# Altium project LEDMiniCube.PrjPcb
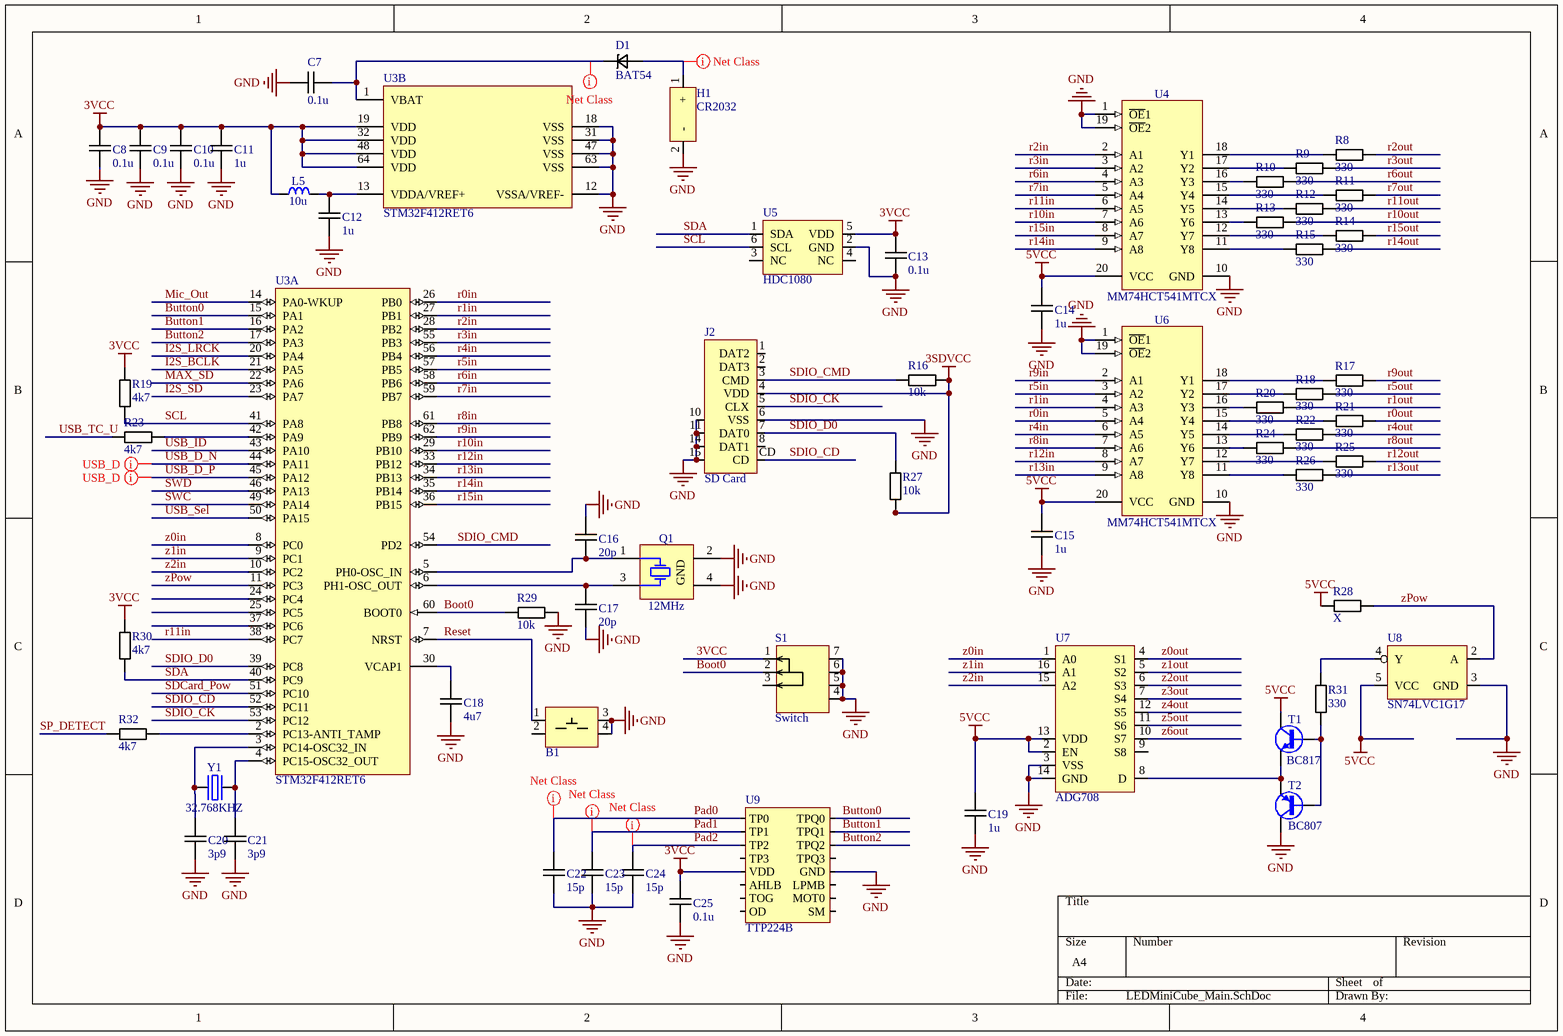
[diagram p0: LEDMiniCube_Main.SchDoc]
3 sheets, 142 parts. Net scope: global (net labels, ports and power ports of the same name join across sheets).
Board file: LEDMiniCube_PCB.PcbDoc
Sheets:
  LEDMiniCube_Main.SchDoc
  LEDMiniCube_PowerAndAnalog.SchDoc
  LEDMiniCube_AAmp.SchDoc

## Sheet LEDMiniCube_Main.SchDoc
size A4

### Parts
B1  Button 5.2  [Button 5.2x5.2]  (value not drawn)
C7  0.1u  [CAPC1608L]
C8  0.1u  [CAPC1608L]
C9  0.1u  [CAPC1608L]
C10  0.1u  [CAPC1608L]
C11  1u  [CAPC1608L]
C12  1u  [CAPC1608L]
C13  0.1u  [CAPC1608L]
C14  1u  [CAPC2012L]
C15  1u  [CAPC2012L]
C16  20p  [CAPC1608L]
C17  20p  [CAPC1608L]
C18  4u7  [CAPC2012L]
C19  1u  [CAPC2012L]
C20  3p9  [CAPC1608L]
C21  3p9  [CAPC1608L]
C22  15p  [CAPC1608L]
C23  15p  [CAPC1608L]
C24  15p  [CAPC1608L]
C25  0.1u  [CAPC1608L]
D1  BAT54  [SOD-323F]
H1  CR2032  [Battery Holder cr2032]
J2  SD Card  [XUNPU TF-115]
L5  10u  [IND_ABRACON_AISC-0603]
Q1  12MHz  [XTAL_TXC_7M]
R8  330  [RESC2012L]
R9  330  [RESC2012L]
R10  330  [RESC2012L]
R11  330  [RESC2012L]
R12  330  [RESC2012L]
R13  330  [RESC2012L]
R14  330  [RESC2012L]
R15  330  [RESC2012L]
R16  10k  [RESC1608L]
R17  330  [RESC2012L]
R18  330  [RESC2012L]
R19  4k7  [RESC1608L]
R20  330  [RESC2012L]
R21  330  [RESC2012L]
R22  330  [RESC2012L]
R23  4k7  [RESC1608L]
R24  330  [RESC2012L]
R25  330  [RESC2012L]
R26  330  [RESC2012L]
R27  10k  [RESC1608L]
R28  X  [RESC1608L]
R29  10k  [RESC1608L]
R30  4k7  [RESC1608L]
R31  330  [RESC1608L]
R32  4k7  [RESC1608L]
S1  Switch  [TA-3524A-A1]
T1  BC817  [SOT95P230X110-3N]
T2  BC807  [SOT95P230X110-3N]
U3  STM32F412RET6  [STM-LQFP64_N]  (parts A,B of 2)
U4  MM74HCT541MTCX  [TSOP65P640X120-20N]
U5  HDC1080  [WSON HDC1080]
U6  MM74HCT541MTCX  [TSOP65P640X120-20N]
U7  ADG708  [TSOP65P640X110-16N]
U8  SN74LVC1G17  [SOT23-5AL]
U9  TTP224B  [SOP65P640-16L]
Y1  32.768KHZ  [XTAL_ABRACON_ABS09]

### Nets
3SDVCC: J2.4(VDD) R16.2 R27.1
3VCC: C8.2 C9.2 C10.2 C11.2 C13.2 C25.2 L5.1 R19.2 R30.2 S1.1 U3.19(VDD) U3.32(VDD) U3.48(VDD) U3.64(VDD) U5.5(VDD) U9.6(VDD)
5VCC: C14.2 C15.2 C19.2 R28.2 T1.3(C) U4.20(VCC) U6.20(VCC) U7.2(EN) U7.13(VDD) U8.5(VCC)
GND: B1.3 B1.4 C7.2 C8.1 C9.1 C10.1 C11.1 C12.1 C13.1 C14.1 C15.1 C16.2 C17.1 C18.1 C19.1 C20.1 C21.1 C22.1 C23.1 C24.1 C25.1 H1.2(-) J2.6(VSS) J2.10 J2.11 J2.14 J2.15 Q1.2(GND) Q1.4(GND) R29.2 S1.4 S1.5 S1.6 S1.7 T2.3(C) U3.12(VSSA/VREF-) U3.18(VSS) U3.31(VSS) U3.47(VSS) U3.63(VSS) U4.1(~{OE}1) U4.10(GND) U4.19(~{OE}2) U5.2(GND) U6.1(~{OE}1) U6.10(GND) U6.19(~{OE}2) U7.3(VSS) U7.14(GND) U8.3(GND) U9.10(GND)
Boot0: R29.1 S1.2 U3.60(BOOT0)
Button0: U3.15(PA1) U9.16(TPQ0)
Button1: U3.16(PA2) U9.15(TPQ1)
Button2: U3.17(PA3) U9.14(TPQ2)
I2S_BCLK: U3.21(PA5)
I2S_LRCK: U3.20(PA4)
I2S_SD: U3.23(PA7)
MAX_SD: U3.22(PA6)
Mic_Out: U3.14(PA0-WKUP)
Pad0: C22.2 U9.1(TP0)
Pad1: C23.2 U9.2(TP1)
Pad2: C24.2 U9.3(TP2)
r0in: U3.26(PB0) U6.5(A4)
r0out: R21.2
r1in: U3.27(PB1) U6.4(A3)
r1out: R20.2
r2in: U3.28(PB2) U4.2(A1)
r2out: R8.2
r3in: U3.55(PB3) U4.3(A2)
r3out: R9.2
r4in: U3.56(PB4) U6.6(A5)
r4out: R22.2
r5in: U3.57(PB5) U6.3(A2)
r5out: R18.2
r6in: U3.58(PB6) U4.4(A3)
r6out: R10.2
r7in: U3.59(PB7) U4.5(A4)
r7out: R11.2
r8in: U3.61(PB8) U6.7(A6)
r8out: R24.2
r9in: U3.62(PB9) U6.2(A1)
r9out: R17.2
r10in: U3.29(PB10) U4.7(A6)
r10out: R13.2
r11in: U3.38(PC7) U4.6(A5)
r11out: R12.2
r12in: U3.33(PB12) U6.8(A7)
r12out: R25.2
r13in: U3.34(PB13) U6.9(A8)
r13out: R26.2
r14in: U3.35(PB14) U4.9(A8)
r14out: R15.2
r15in: U3.36(PB15) U4.8(A7)
r15out: R14.2
Reset: B1.1 U3.7(NRST)
SCL: R19.1 U3.41(PA8) U5.6(SCL)
SDA: R30.1 U3.40(PC9) U5.1(SDA)
SDCard_Pow: U3.51(PC10)
SDIO_CD: J2.CD U3.52(PC11)
SDIO_CK: J2.5(CLX) U3.53(PC12)
SDIO_CMD: J2.3(CMD) R16.1 U3.54(PD2)
SDIO_D0: J2.7(DAT0) R27.2 U3.39(PC8)
SP_DETECT: R32.1
SWC: U3.49(PA14)
SWD: U3.46(PA13)
USB_D_N: U3.44(PA11)
USB_D_P: U3.45(PA12)
USB_ID: U3.43(PA10)
USB_Sel: U3.50(PA15)
USB_TC_U: R23.1
z0in: U3.8(PC0) U7.1(A0)
z0out: U7.4(S1)
z1in: U3.9(PC1) U7.16(A1)
z1out: U7.5(S2)
z2in: U3.10(PC2) U7.15(A2)
z2out: U7.6(S3)
z3out: U7.7(S4)
z4out: U7.12(S5)
z5out: U7.11(S6)
z6out: U7.10(S7)
zPow: R28.1 U3.11(PC3) U8.2(A)
NetC7_1: C7.1 D1.2 U3.1(VBAT)
NetC12_2: C12.2 L5.2 U3.13(VDDA/VREF+)
NetC16_1: C16.1 Q1.1(X) U3.5(PH0-OSC_IN)
NetC17_2: C17.2 Q1.3(X) U3.6(PH1-OSC_OUT)
NetC18_2: C18.2 U3.30(VCAP1)
NetC20_2: C20.2 U3.3(PC14-OSC32_IN) Y1.1(OSC1)
NetC21_2: C21.2 U3.4(PC15-OSC32_OUT) Y1.2(OSC2)
NetD1_1: D1.1 H1.1(+)
NetR8_1: R8.1 U4.18(Y1)
NetR9_1: R9.1 U4.17(Y2)
NetR10_1: R10.1 U4.16(Y3)
NetR11_1: R11.1 U4.15(Y4)
NetR12_1: R12.1 U4.14(Y5)
NetR13_1: R13.1 U4.13(Y6)
NetR14_1: R14.1 U4.12(Y7)
NetR15_1: R15.1 U4.11(Y8)
NetR17_1: R17.1 U6.18(Y1)
NetR18_1: R18.1 U6.17(Y2)
NetR20_1: R20.1 U6.16(Y3)
NetR21_1: R21.1 U6.15(Y4)
NetR22_1: R22.1 U6.14(Y5)
NetR23_2: R23.2 U3.42(PA9)
NetR24_1: R24.1 U6.13(Y6)
NetR25_1: R25.1 U6.12(Y7)
NetR26_1: R26.1 U6.11(Y8)
NetR31_1: R31.1 T1.1(B) T2.1(B)
NetR31_2: R31.2 U8.4(Y)
NetR32_2: R32.2 U3.2(PC13-ANTI_TAMP)
NetT1_2: T1.2(E) T2.2(E) U7.8(D)

Not connected (* = marked no-connect by the designer): B1 2; J2 1(DAT2) 2(DAT3) 8(DAT1); S1 3; U3 24(PC4) 25(PC5) 37(PC6); U5 3(NC) 4(NC); U7 9(S8); U9 4(TP3) 5(AHLB) 7(TOG) 8(LPMB) 9(MOT0) 11(OD) 12(SM) 13(TPQ3)

### Layout directives
differential pair: USB_D_N, USB_D_P
net class Clearance5; rule Clearance Constraint [Generic clearance = 0.15mm, and 30 value(s) for objects]: NetD1_1
net class Clearance5; rule Clearance Constraint [Generic clearance = 0.15mm, and 21 value(s) for objects]: NetC7_1
net class Clearance5: Pad0, Pad1, Pad2

### Library data of the parts
C7-C25 = Capacitor: Name: *; Case: *
  C7-C10 C13 C25: Value: 0.1u
  C11 C12 C14 C15 C19: Value: 1u
  C16 C17: Value: 20p
  C18: Value: 4u7
  C20 C21: Value: 3p9
  C22-C24: Value: 15p
D1 = Schotky: Name: BAT54; Case: *; Value: *
J2 = SD Card Socket: Name: SD Card
L5 = IND_390NH_5%_ABRACON_AISC-0603: Inductor; Value: 10u; Author: CERN DEM JLC
Q1 = XTAL_12MHZ_TXC_7M-12.000MAAJ-T: Crystal 4 pins 1=XTAL Control 2=GND3=XTAL 4=GND; Part Description: ±30ppm 18pF -20°C to +70°C  4 Pins, 3.2x2.5X0.8mm, SMD Sealing Crystal, 7M Series; Manufacturer: TXC CORPORATION; PressFit: No; Bonding: No; Part Number: XTAL_12MHZ_TXC_7M-12.000MAAJ-T; Component Kind: Standard; Component Type: Standard; PackageDescription: 4 Pins, 2.5x3.2mm, SMD Sealing Crystal, 7M Serie; Value: 12MHz; Manufacturer Part Number: 7M-12.000MAAJ-T; Pin Count: 4; Mounted: Yes; Socket: No; SMD: Yes; Sense: No; ComponentHeight: 0.8mm; HelpURL: \\cern.ch\dfs\Applications\Altium\Datasheets\XTAL_TXC_7M.pdf; Author: CERN DEM JLC; CreateDate: 19.06.2012; LatestRevisionDate: 19.06.2012
R8-R32 = Resistor: Model: *; Case: *
  R8-R15 R17 R18 R20-R22 R24-R26 R31: Value: 330
  R16 R27 R29: Value: 10k
  R19 R23 R30 R32: Value: 4k7
  R28: Value: X
T1 = BC817: NPN Transistor; Part Number: BC817-40; Device: BC817; Author: CERN DEM JLC
T2 = BC807-25: PNP Transistor; Part Number: BC807-40; Device: BC807; Author: CERN DEM JLC
U3 = STM32F401RBT6: ARM Cortex-M4 32-bit MCU+FPU, 105 DMIPS, 128 kB Flash, 64 kB Internal RAM, 48 I/Os, 64-pin LQFP, -40 to 85 degC, Tray; PartNumber: STM32F412RET6
U4 U6 = 74541: Octal Buffer/Line Driver with 3-State Outputs; Device: MM74HCT541MTCX
U7 = ADG708: Part: ADG708BRUZ; Name: ADG708
U8 = SN74LVC1G04: Part: SN74LVC1G17DBVR; Name: SN74LVC1G17
U9 = TTP224: Name: TTP224B
Y1 = XTAL_32.768KHZ_ABRACON_ABS09-32.768KHZ-T: Quartz Crystal; Part Description: Tolerance: ±20ppm, Stability: ±5ppm, -40°C to +85°C, 12.5pF, SMD Low Profile Crystal, ABS09 Series; PressFit: No; Bonding: No; Part Number: XTAL_32.768KHZ_ABRACON_ABS09-32.768KHZ-T; Component Kind: Standard; Component Type: Standard; PackageDescription: 2 Pins, 4.1x1.5mm, SMD Low Profile Crystal, ABS09 Serie; Value: 32.768KHZ; Manufacturer: ABRACON; Manufacturer Part Number: ABS09-32.768KHZ-T; Pin Count: 2; Mounted: Yes; Socket: No; SMD: Yes; Sense: No; ComponentHeight: 0.9mm; HelpURL: \\cern.ch\dfs\Applications\Altium\Datasheets\XTAL_ABRACON_ABS09.pdf; Author: CERN DEM JLC; CreateDate: 16.10.2014; LatestRevisionDate: 16.10.2014
H1 = CR2032: Name: CR2032; Part: *
S1 = Switch: Name: Switch
U5 = HDC1080: Name: HDC1080; Part: *

## Sheet LEDMiniCube_PowerAndAnalog.SchDoc
size A4
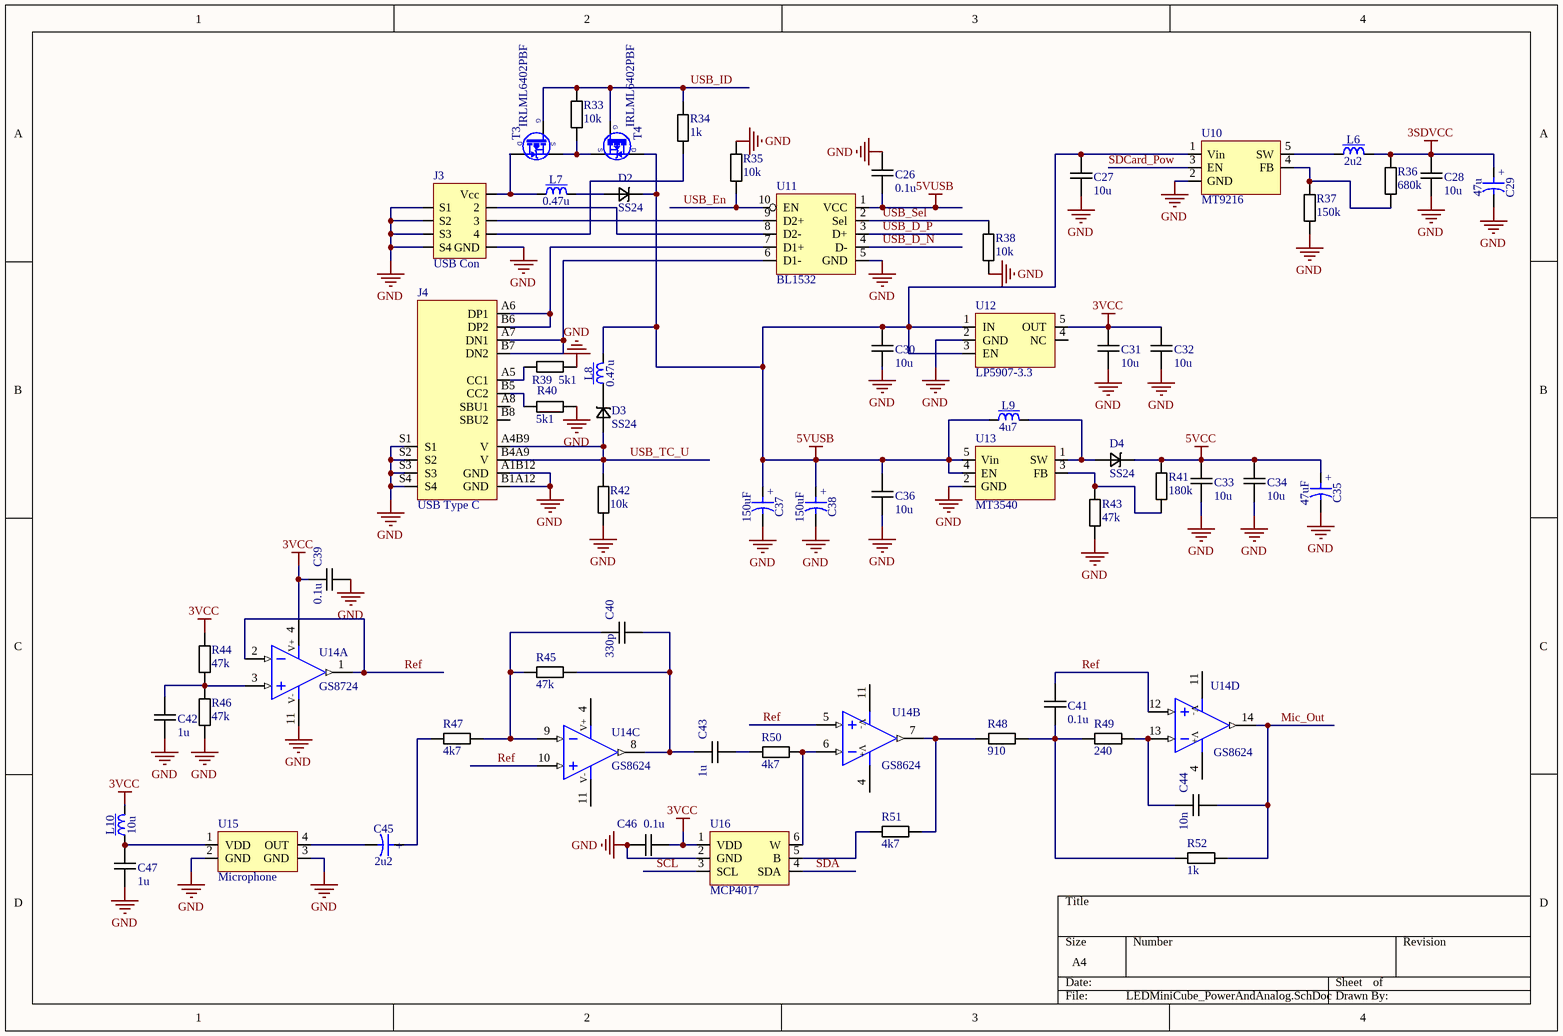
[diagram p1: LEDMiniCube_PowerAndAnalog.SchDoc]

### Parts
C26  0.1u  [CAPC1608L]
C27  10u  [CAPC2012L]
C28  10u  [CAPC2012L]
C29  47u  [CAPMP3216X180N]
C30  10u  [CAPC2012L]
C31  10u  [CAPC2012L]
C32  10u  [CAPC2012L]
C33  10u  [CAPC3216L]
C34  10u  [CAPC3216L]
C35  47uF  [CAPMP3528X120N]
C36  10u  [CAPC2012L]
C37  150uF  [CAPMP7343X200N]
C38  150uF  [CAPMP7343X200N]
C39  0.1u  [CAPC1608L]
C40  330p  [CAPC1608L]
C41  0.1u  [CAPC1608L]
C42  1u  [CAPC1608L]
C43  1u  [CAPC2012L]
C44  10n  [CAPC1608L]
C45  2u2  [CAPMP3216X180N]
C46  0.1u  [CAPC1608L]
C47  1u  [CAPC1608L]
D2  SS24  [SOD-123F]
D3  SS24  [SOD-123F]
D4  SS24  [SOD-123F]
J3  USB Con  [ZX62D]
J4  USB Type C  [U262-161N-4BVC11]
L6  2u2  [IND_COILCRAFT_1206CS]
L7  0.47u  [IND_COILCRAFT_0805CS]
L8  0.47u  [IND_COILCRAFT_0805CS]
L9  4u7  [IND_COILCRAFT_1206CS]
L10  10u  [INDC2012L]
R33  10k  [RESC1608L]
R34  1k  [RESC1608L]
R35  10k  [RESC1608L]
R36  680k  [RESC1608L]
R37  150k  [RESC1608L]
R38  10k  [RESC1608L]
R39  5k1  [RESC1608L]
R40  5k1  [RESC1608L]
R41  180k  [RESC1608L]
R42  10k  [RESC1608L]
R43  47k  [RESC1608L]
R44  47k  [RESC1608L]
R45  47k  [RESC1608L]
R46  47k  [RESC1608L]
R47  4k7  [RESC1608L]
R48  910  [RESC1608L]
R49  240  [RESC1608L]
R50  4k7  [RESC1608L]
R51  4k7  [RESC1608L]
R52  1k  [RESC1608L]
T3  IRLML6402PBF  [SOT95P237X112-3N]
T4  IRLML6402PBF  [SOT95P237X112-3N]
U10  MT9216  [SOT23-5AL]
U11  BL1532  [TSSOP50P490X110-10N]
U12  LP5907-3.3  [SOT95P280X145-5M]
U13  MT3540  [SOT23-5AL]
U14  GS8724  [SOP65P640X120-14N]  (parts A,B,C,D of 4)
U15  Microphone  [Microphone 3.76x2.95]
U16  MCP4017  [SOT65P210X110-6M]

### Nets
3SDVCC: C28.2 C29.1 L6.2 R36.2
3VCC: C31.2 C32.2 C39.1 C46.2 L10.2 R44.2 U12.5(OUT) U14.4(V+) U16.1(VDD)
5VCC: C33.2 C34.2 C35.1 D4.2 R41.2
5VUSB: C26.1 C27.2 C30.2 C36.2 C37.1 C38.1 D2.2 L8.2 L9.1 T4.3(D) U10.1(Vin) U11.1(VCC) U12.1(IN) U12.3(EN) U13.4(EN) U13.5(Vin)
GND: C26.2 C27.1 C28.1 C29.2 C30.1 C31.1 C32.1 C33.1 C34.1 C35.2 C36.1 C37.2 C38.2 C39.2 C42.1 C46.1 C47.1 J3.5(GND) J3.S1 J3.S2 J3.S3 J3.S4 J4.A1B12(GND) J4.B1A12(GND) J4.S1 J4.S2 J4.S3 J4.S4 R35.2 R37.1 R38.1 R39.2 R40.2 R42.1 R43.1 R46.1 U10.2(GND) U11.5(GND) U12.2(GND) U13.2(GND) U14.11(V-) U15.2(GND) U15.3(GND) U16.2(GND)
Mic_Out: C44.2 R52.2 U14.14(OUT)
Ref: C41.2 U14.1(OUT) U14.2(IN-) U14.5(IN+) U14.10(IN+) U14.12(IN+)
SCL: U16.3(SCL)
SDA: U16.4(SDA)
SDCard_Pow: U10.3(EN)
USB_D_N: U11.4(D-)
USB_D_P: U11.3(D+)
USB_En: R35.1 U11.10(EN)
USB_ID: R33.2 R34.2 T3.1(G) T4.1(G)
USB_Sel: R38.2 U11.2(Sel)
USB_TC_U: D3.1 J4.A4B9(V) J4.B4A9(V) R42.2
NetC40_1: C40.1 R45.1 R47.2 U14.9(IN-)
NetC40_2: C40.2 C43.1 R45.2 U14.8(OUT)
NetC41_1: C41.1 R48.2 R49.1 R52.1
NetC42_2: C42.2 R44.1 R46.2 U14.3(IN+)
NetC43_2: C43.2 R50.1
NetC44_1: C44.1 R49.2 U14.13(IN-)
NetC45_1: C45.1 R47.1
NetC45_2: C45.2 U15.4(OUT)
NetC47_2: C47.2 L10.1 U15.1(VDD)
NetD2_1: D2.1 L7.2
NetD3_2: D3.2 L8.1
NetD4_1: D4.1 L9.2 U13.1(SW)
NetJ3_1: J3.1(Vcc) L7.1 T3.3(D)
NetJ3_2: J3.2 U11.8(D2-)
NetJ3_3: J3.3 U11.9(D2+)
NetJ3_4: J3.4 R34.1
NetJ4_A5: J4.A5(CC1) R39.1
NetJ4_A6: J4.A6(DP1) J4.B6(DP2) U11.7(D1+)
NetJ4_A7: J4.A7(DN1) J4.B7(DN2) U11.6(D1-)
NetJ4_B5: J4.B5(CC2) R40.1
NetL6_1: L6.1 U10.5(SW)
NetR33_1: R33.1 T3.2(S) T4.2(S)
NetR36_1: R36.1 R37.2 U10.4(FB)
NetR41_1: R41.1 R43.2 U13.3(FB)
NetR48_1: R48.1 R51.2 U14.7(OUT)
NetR50_2: R50.2 U14.6(IN-) U16.6(W)
NetR51_1: R51.1 U16.5(B)

Not connected (* = marked no-connect by the designer): J4 A8(SBU1) B8(SBU2); U12 4(NC)

### Notes on the sheet
- (in symbol CAEM7343-20_150UF_2V_20%_LESR0009) +
- (in symbol CTE3216-18_100UF_6.3V_20%_ESR0500_AVX_TLJ) +
- (in symbol CTE3528-12_47UF_10V_20%_PANASONIC_TPG) +

### Library data of the parts
C26-C28 C30-C34 C36 C39-C44 C46 C47 = Capacitor: Name: *; Case: *
  C26 C39 C41 C46: Value: 0.1u
  C27 C28 C30-C34 C36: Value: 10u
  C40: Value: 330p
  C42 C43 C47: Value: 1u
  C44: Value: 10n
C29 C45 = CTE3216-18_100UF_6.3V_20%_ESR0500_AVX_TLJ: Polarised capacitor; Part Description: ESR 0R5 Solid Tantalum Chip Capacitor; Manufacturer: AVX; Manufacturer Part Number: TLJA107M006R0500; Voltage: 6.3V; Tolerance: ±20%; Part Number: CTE3216-18_100UF_6.3V_20%_ESR0500_AVX_TLJ; Component Kind: Standard; Component Type: Standard; Pin Count: 2; Status: None; Case: A; Mounted: Yes; Socket: No; SMD: Yes; Sense: No; ComponentHeight: 1.8mm; HelpURL: \\cern.ch\dfs\Applications\Altium\Datasheets\CTE_AVX_TLJ.pdf; Author: CERN DEM JLC; CreateDate: 19.12.2013; LatestRevisionDate: 19.12.2013
  C29: Value: 47u
  C45: Value: 2u2
C35 = CTE3528-12_47UF_10V_20%_PANASONIC_TPG: Polarised capacitor; Voltage: 10V; Value: 47uF; Case: B; Author: CERN DEM JLC
C37 C38 = CAEM7343-20_150UF_2V_20%_LESR0009: Polarised capacitor; Voltage: 6.3V; Value: 150uF; Author: CERN DEM JLC
D2-D4 = Schotky: Name: SS24; Case: *; Value: *
J3 = USB: Case: *; Name: *; Datasheet: https://media.digikey.com/pdf/Data%20Sheets/Hirose%20PDFs/ZX62D-AB-5P8%20RoHS.pdf
J4 = USB_TypeC: Name: USB Type C; Part: U262-161N-4BVC11
L6 L9 L10 = IND_620NH_5%_COILCRAFT_1206CS: Inductor With Core; Author: CERN DEM JLC
  L6: Value: 2u2
  L9: Value: 4u7
  L10: Value: 10u
L7 L8 = IND_150NH_2%_COILCRAFT_0805CS: Inductor With Core; Value: 0.47u; Author: CERN DEM JLC
R33-R52 = Resistor: Model: *; Case: *
  R33 R35 R38 R42: Value: 10k
  R34 R52: Value: 1k
  R36: Value: 680k
  R37: Value: 150k
  R39 R40: Value: 5k1
  R41: Value: 180k
  R43-R46: Value: 47k
  R47 R50 R51: Value: 4k7
  R48: Value: 910
  R49: Value: 240
T3 T4 = IRLML6402PBF: P-CHANNEL MOSFET WITH ZENER DIODE; Part Number: IRLML6402PBF; Device: IRLML6402PBF; Author: CERN DEM JLC
U10 = LM3671: Name: MT9216
U12 = TLV70233: Part: LP5907MFX-3.3/NOPB; Name: LP5907-3.3
U13 = TPS6104x: Name: MT3540
U14 = AD8624ARUZ: Quad Operational Amplifier; Part Number: GS8624-TR; Device: GS8724; Author: CERN DEM JLC
U15 = Microphone MEMS: Part: *; Name: Microphone
U11 = BL1532: Name: BL1532; Part: *
U16 = MCP4017: Part: *; Name: MCP4017

## Sheet LEDMiniCube_AAmp.SchDoc
size A4
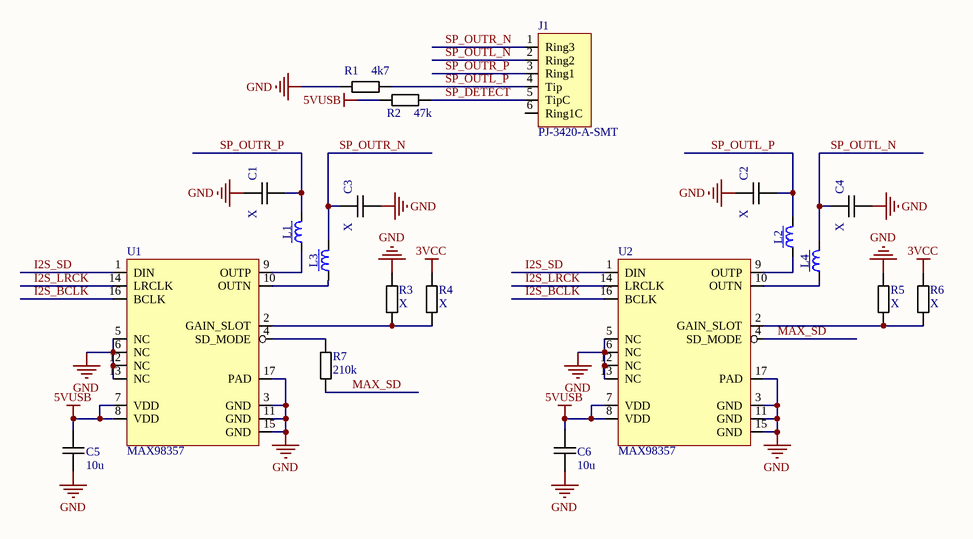
[diagram p2: LEDMiniCube_AAmp.SchDoc]

### Parts
C1  X  [CAPC2012L]
C2  X  [CAPC2012L]
C3  X  [CAPC2012L]
C4  X  [CAPC2012L]
C5  10u  [CAPC2012L]
C6  10u  [CAPC2012L]
J1  PJ-3420-A-SMT  [PJ-3420-A-SMT]
L1  (no value)  [INDC2012L]
L2  (no value)  [INDC2012L]
L3  (no value)  [INDC2012L]
L4  (no value)  [INDC2012L]
R1  4k7  [RESC1608L]
R2  47k  [RESC1608L]
R3  X  [RESC1608L]
R4  X  [RESC1608L]
R5  X  [RESC1608L]
R6  X  [RESC1608L]
R7  210k  [RESC1608L]
U1  MAX98357  [PQFN50P300X300X80_HS-17N]
U2  MAX98357  [PQFN50P300X300X80_HS-17N]

### Nets
3VCC: R4.2 R6.2
5VUSB: C5.2 C6.2 R2.1 U1.7(VDD) U1.8(VDD) U2.7(VDD) U2.8(VDD)
GND: C1.1 C2.1 C3.2 C4.2 C5.1 C6.1 R1.1 R3.2 R5.2 U1.3(GND) U1.5(NC) U1.6(NC) U1.11(GND) U1.12(NC) U1.13(NC) U1.15(GND) U1.17(PAD) U2.3(GND) U2.5(NC) U2.6(NC) U2.11(GND) U2.12(NC) U2.13(NC) U2.15(GND) U2.17(PAD)
I2S_BCLK: U1.16(BCLK) U2.16(BCLK)
I2S_LRCK: U1.14(LRCLK) U2.14(LRCLK)
I2S_SD: U1.1(DIN) U2.1(DIN)
MAX_SD: R7.2 U2.4(SD_MODE)
SP_DETECT: J1.5(TipC) R2.2
SP_OUTL_N: C4.1 J1.2(Ring2) L4.2
SP_OUTL_P: C2.2 J1.4(Tip) L2.2 R1.2
SP_OUTR_N: C3.1 J1.1(Ring3) L3.2
SP_OUTR_P: C1.2 J1.3(Ring1) L1.2
NetL1_1: L1.1 U1.9(OUTP)
NetL2_1: L2.1 U2.9(OUTP)
NetL3_1: L3.1 U1.10(OUTN)
NetL4_1: L4.1 U2.10(OUTN)
NetR3_1: R3.1 R4.1 U1.2(GAIN_SLOT)
NetR5_1: R5.1 R6.1 U2.2(GAIN_SLOT)
NetR7_1: R7.1 U1.4(SD_MODE)

Not connected (* = marked no-connect by the designer): J1 6(Ring1C)

### Library data of the parts
C1-C6 = Capacitor: Name: *; Case: *
  C1-C4: Value: X
  C5 C6: Value: 10u
J1 = 3.5 socket PJ-3420-A-SMT: Name: PJ-3420-A-SMT; Part: *
L1-L4 = IND_150NH_2%_COILCRAFT_0805CS: Inductor With Core; Author: CERN DEM JLC
R1-R7 = Resistor: Model: *; Case: *
  R1: Value: 4k7
  R2: Value: 47k
  R3-R6: Value: X
  R7: Value: 210k
U1 U2 = MAX98357: Part: MAX98357A; Name: MAX98357

## Nets that join several sheets
3SDVCC: LEDMiniCube_Main (J2.4 R16.2 R27.1), LEDMiniCube_PowerAndAnalog (C28.2 C29.1 L6.2 R36.2)
3VCC: LEDMiniCube_Main (16 pins), LEDMiniCube_PowerAndAnalog (9 pins), LEDMiniCube_AAmp (R4.2 R6.2)
5VCC: LEDMiniCube_Main (10 pins), LEDMiniCube_PowerAndAnalog (5 pins)
5VUSB: LEDMiniCube_PowerAndAnalog (16 pins), LEDMiniCube_AAmp (7 pins)
GND: LEDMiniCube_Main (51 pins), LEDMiniCube_PowerAndAnalog (44 pins), LEDMiniCube_AAmp (25 pins)
I2S_BCLK: LEDMiniCube_Main (U3.21), LEDMiniCube_AAmp (U1.16 U2.16)
I2S_LRCK: LEDMiniCube_Main (U3.20), LEDMiniCube_AAmp (U1.14 U2.14)
I2S_SD: LEDMiniCube_Main (U3.23), LEDMiniCube_AAmp (U1.1 U2.1)
MAX_SD: LEDMiniCube_Main (U3.22), LEDMiniCube_AAmp (R7.2 U2.4)
Mic_Out: LEDMiniCube_Main (U3.14), LEDMiniCube_PowerAndAnalog (C44.2 R52.2 U14.14)
SCL: LEDMiniCube_Main (R19.1 U3.41 U5.6), LEDMiniCube_PowerAndAnalog (U16.3)
SDA: LEDMiniCube_Main (R30.1 U3.40 U5.1), LEDMiniCube_PowerAndAnalog (U16.4)
SDCard_Pow: LEDMiniCube_Main (U3.51), LEDMiniCube_PowerAndAnalog (U10.3)
SP_DETECT: LEDMiniCube_Main (R32.1), LEDMiniCube_AAmp (J1.5 R2.2)
USB_D_N: LEDMiniCube_Main (U3.44), LEDMiniCube_PowerAndAnalog (U11.4)
USB_D_P: LEDMiniCube_Main (U3.45), LEDMiniCube_PowerAndAnalog (U11.3)
USB_ID: LEDMiniCube_Main (U3.43), LEDMiniCube_PowerAndAnalog (R33.2 R34.2 T3.1 T4.1)
USB_Sel: LEDMiniCube_Main (U3.50), LEDMiniCube_PowerAndAnalog (R38.2 U11.2)
USB_TC_U: LEDMiniCube_Main (R23.1), LEDMiniCube_PowerAndAnalog (D3.1 J4.A4B9 J4.B4A9 R42.2)